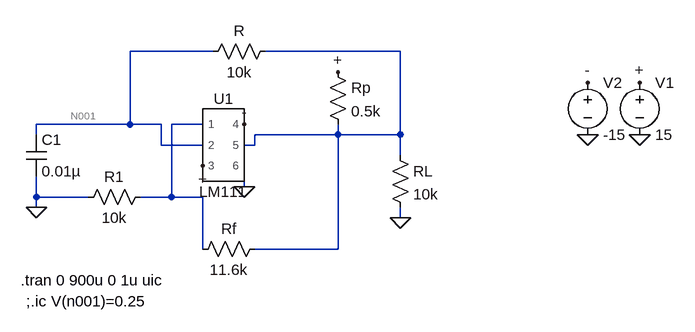
[diagram p0: schematic Onda Cuadrada Ejemplo 16-3.asc]
Onda Cuadrada Ejemplo 16-3.asc, the LTspice schematic file:
Version 4
SHEET 1 880 680
WIRE 96 64 -32 64
WIRE 384 64 176 64
WIRE -32 176 -32 64
WIRE -32 176 -176 176
WIRE 16 176 -32 176
WIRE 80 176 32 176
WIRE -176 192 -176 176
WIRE 288 192 288 176
WIRE 288 192 160 192
WIRE 384 192 384 64
WIRE 384 192 288 192
WIRE 16 208 16 176
WIRE 80 208 16 208
WIRE 160 208 160 192
WIRE 160 208 144 208
WIRE 384 224 384 192
WIRE 144 272 144 240
WIRE -176 288 -176 256
WIRE -96 288 -176 288
WIRE 32 288 32 176
WIRE 32 288 -16 288
WIRE 80 288 32 288
WIRE -176 304 -176 288
WIRE 384 320 384 304
WIRE 80 368 80 288
WIRE 288 368 288 192
WIRE 288 368 160 368
FLAG -176 304 0
FLAG 384 320 0
FLAG 144 176 -
FLAG 672 112 -
FLAG 80 240 +
FLAG 288 96 +
FLAG 752 112 +
FLAG 144 272 0
FLAG 672 192 0
FLAG 752 192 0
SYMBOL LM111 112 208 R0
SYMATTR InstName U1
SYMBOL cap -192 192 R0
SYMATTR InstName C1
SYMATTR Value 0.01µ
SYMBOL res 192 48 R90
WINDOW 0 0 56 VBottom 2
WINDOW 3 32 56 VTop 2
SYMATTR InstName R
SYMATTR Value 10k
SYMBOL res 0 272 R90
WINDOW 0 0 56 VBottom 2
WINDOW 3 32 56 VTop 2
SYMATTR InstName R1
SYMATTR Value 10k
SYMBOL res 176 352 R90
WINDOW 0 0 56 VBottom 2
WINDOW 3 32 56 VTop 2
SYMATTR InstName Rf
SYMATTR Value 11.6k
SYMBOL res 272 80 R0
SYMATTR InstName Rp
SYMATTR Value 0.5k
SYMBOL res 368 208 R0
SYMATTR InstName RL
SYMATTR Value 10k
SYMBOL voltage 752 96 R0
WINDOW 123 0 0 Left 2
WINDOW 39 0 0 Left 2
SYMATTR InstName V1
SYMATTR Value 15
SYMBOL voltage 672 96 R0
WINDOW 123 0 0 Left 2
WINDOW 39 0 0 Left 2
SYMATTR InstName V2
SYMATTR Value -15
TEXT -200 416 Left 2 !.tran 0 900u 0 1u uic
TEXT -192 448 Left 2 !;.ic V(n001)=0.25

The netlist it stands for:
* Onda Cuadrada Ejemplo 16-3.asc
XU1 N003 N001 + - N002 0 LM111  ; pins 1 2 3 4 5 6
C1 N001 0 0.01µ
R N002 N001 10k
R1 N003 0 10k
Rf N002 N003 11.6k
Rp + N002 0.5k
RL N002 0 10k
V1 + 0 15
V2 - 0 -15
.tran 0 900u 0 1u uic
;.ic V(n001)=0.25
.lib /Users/Caro/Downloads/LM111.301
.backanno
.end